# Altium project V_5.PrjPCB
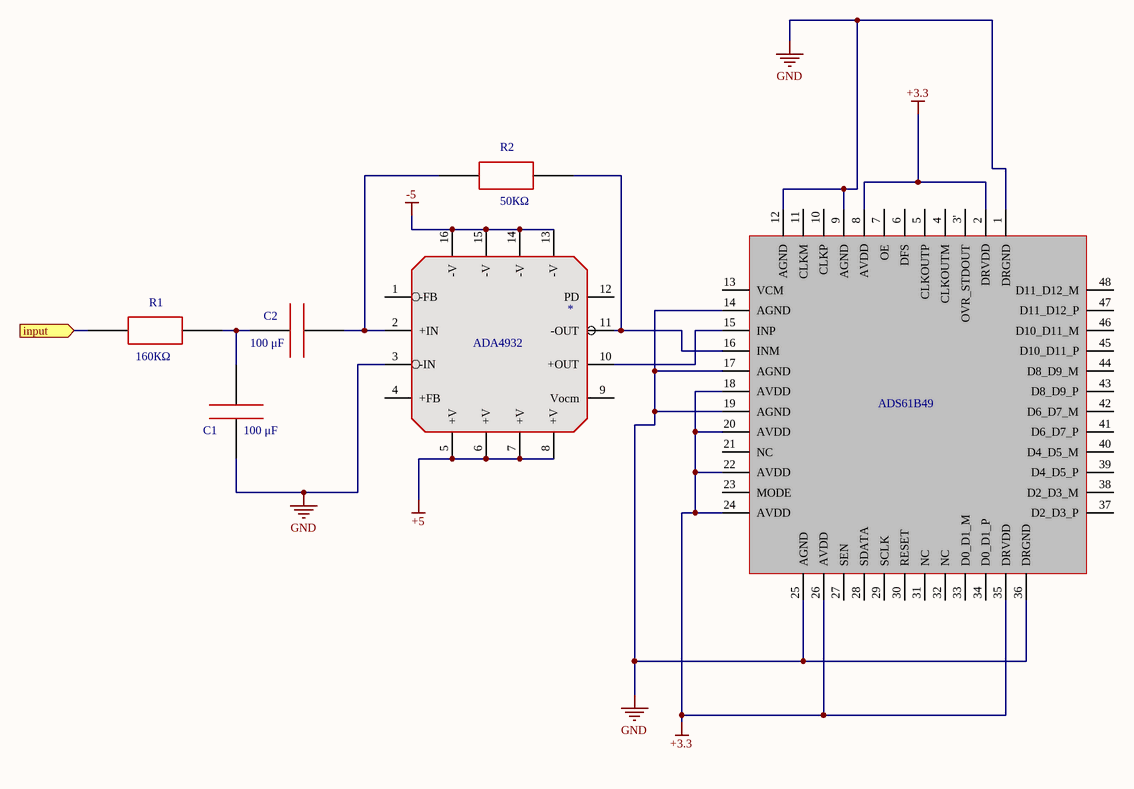
[diagram p0: V_5.SchDoc]
1 sheet, 6 parts. Net scope: flat (ports and power ports of the same name join across sheets).

## Sheet V_5.SchDoc
size A4

### Parts
ADA4932  *  [ADA4932]
ADS61B49  *  [ADS61B49]  (value not drawn)
C1  100 μF  [Capacitor]
C2  100 μF  [Capacitor]
R1  160КΩ  [Resistor]  (net tie)
R2  50КΩ  [Resistor]

### Ports
input

### Nets
+3.3: ADS61B49.2(DRVDD) ADS61B49.8(AVDD) ADS61B49.18(AVDD) ADS61B49.20(AVDD) ADS61B49.22(AVDD) ADS61B49.24(AVDD) ADS61B49.26(AVDD) ADS61B49.35(DRVDD)
+5: ADA4932.5(+V) ADA4932.6(+V) ADA4932.7(+V) ADA4932.8(+V)
-5: ADA4932.13(-V) ADA4932.14(-V) ADA4932.15(-V) ADA4932.16(-V)
GND: ADA4932.3(-IN) ADS61B49.1(DRGND) ADS61B49.9(AGND) ADS61B49.12(AGND) ADS61B49.14(AGND) ADS61B49.17(AGND) ADS61B49.19(AGND) ADS61B49.25(AGND) ADS61B49.36(DRGND) C1.3
NetADA4932_2: ADA4932.2(+IN) C2.2 R2.0
NetADA4932_10: ADA4932.10(+OUT) ADS61B49.15(INP)
NetADA4932_11: ADA4932.11(-OUT) ADS61B49.16(INM) R2.1
NetC1_2: C1.2 C2.3 R1.1
NetR1_0: R1.0 ; port input

Not connected (* = marked no-connect by the designer): ADA4932 1(-FB) 4(+FB) 9(Vocm) 12(PD); ADS61B49 3'(OVR_STDOUT) 4(CLKOUTM) 5(CLKOUTP) 6(DFS) 7(OE) 10(CLKP) 11(CLKM) 13(VCM) 21(NC) 23(MODE) 27(SEN) 28(SDATA) 29(SCLK) 30(RESET) 31(NC) 32(NC) 33(D0_D1_M) 34(D0_D1_P) 37(D2_D3_P) 38(D2_D3_M) 39(D4_D5_P) 40(D4_D5_M) 41(D6_D7_P) 42(D6_D7_M) 43(D8_D9_P) 44(D8_D9_M) 45(D10_D11_P) 46(D10_D11_M) 47(D11_D12_P) 48(D11_D12_M)

### Library data of the parts
ADA4932 = ADA4932
ADS61B49 = ADS61B49
C1 C2 = Capacitor
R1 R2 = Resistor